# Altium project Brushless_driver_FOC_AbsoluteEncoder_V2.PrjPcb
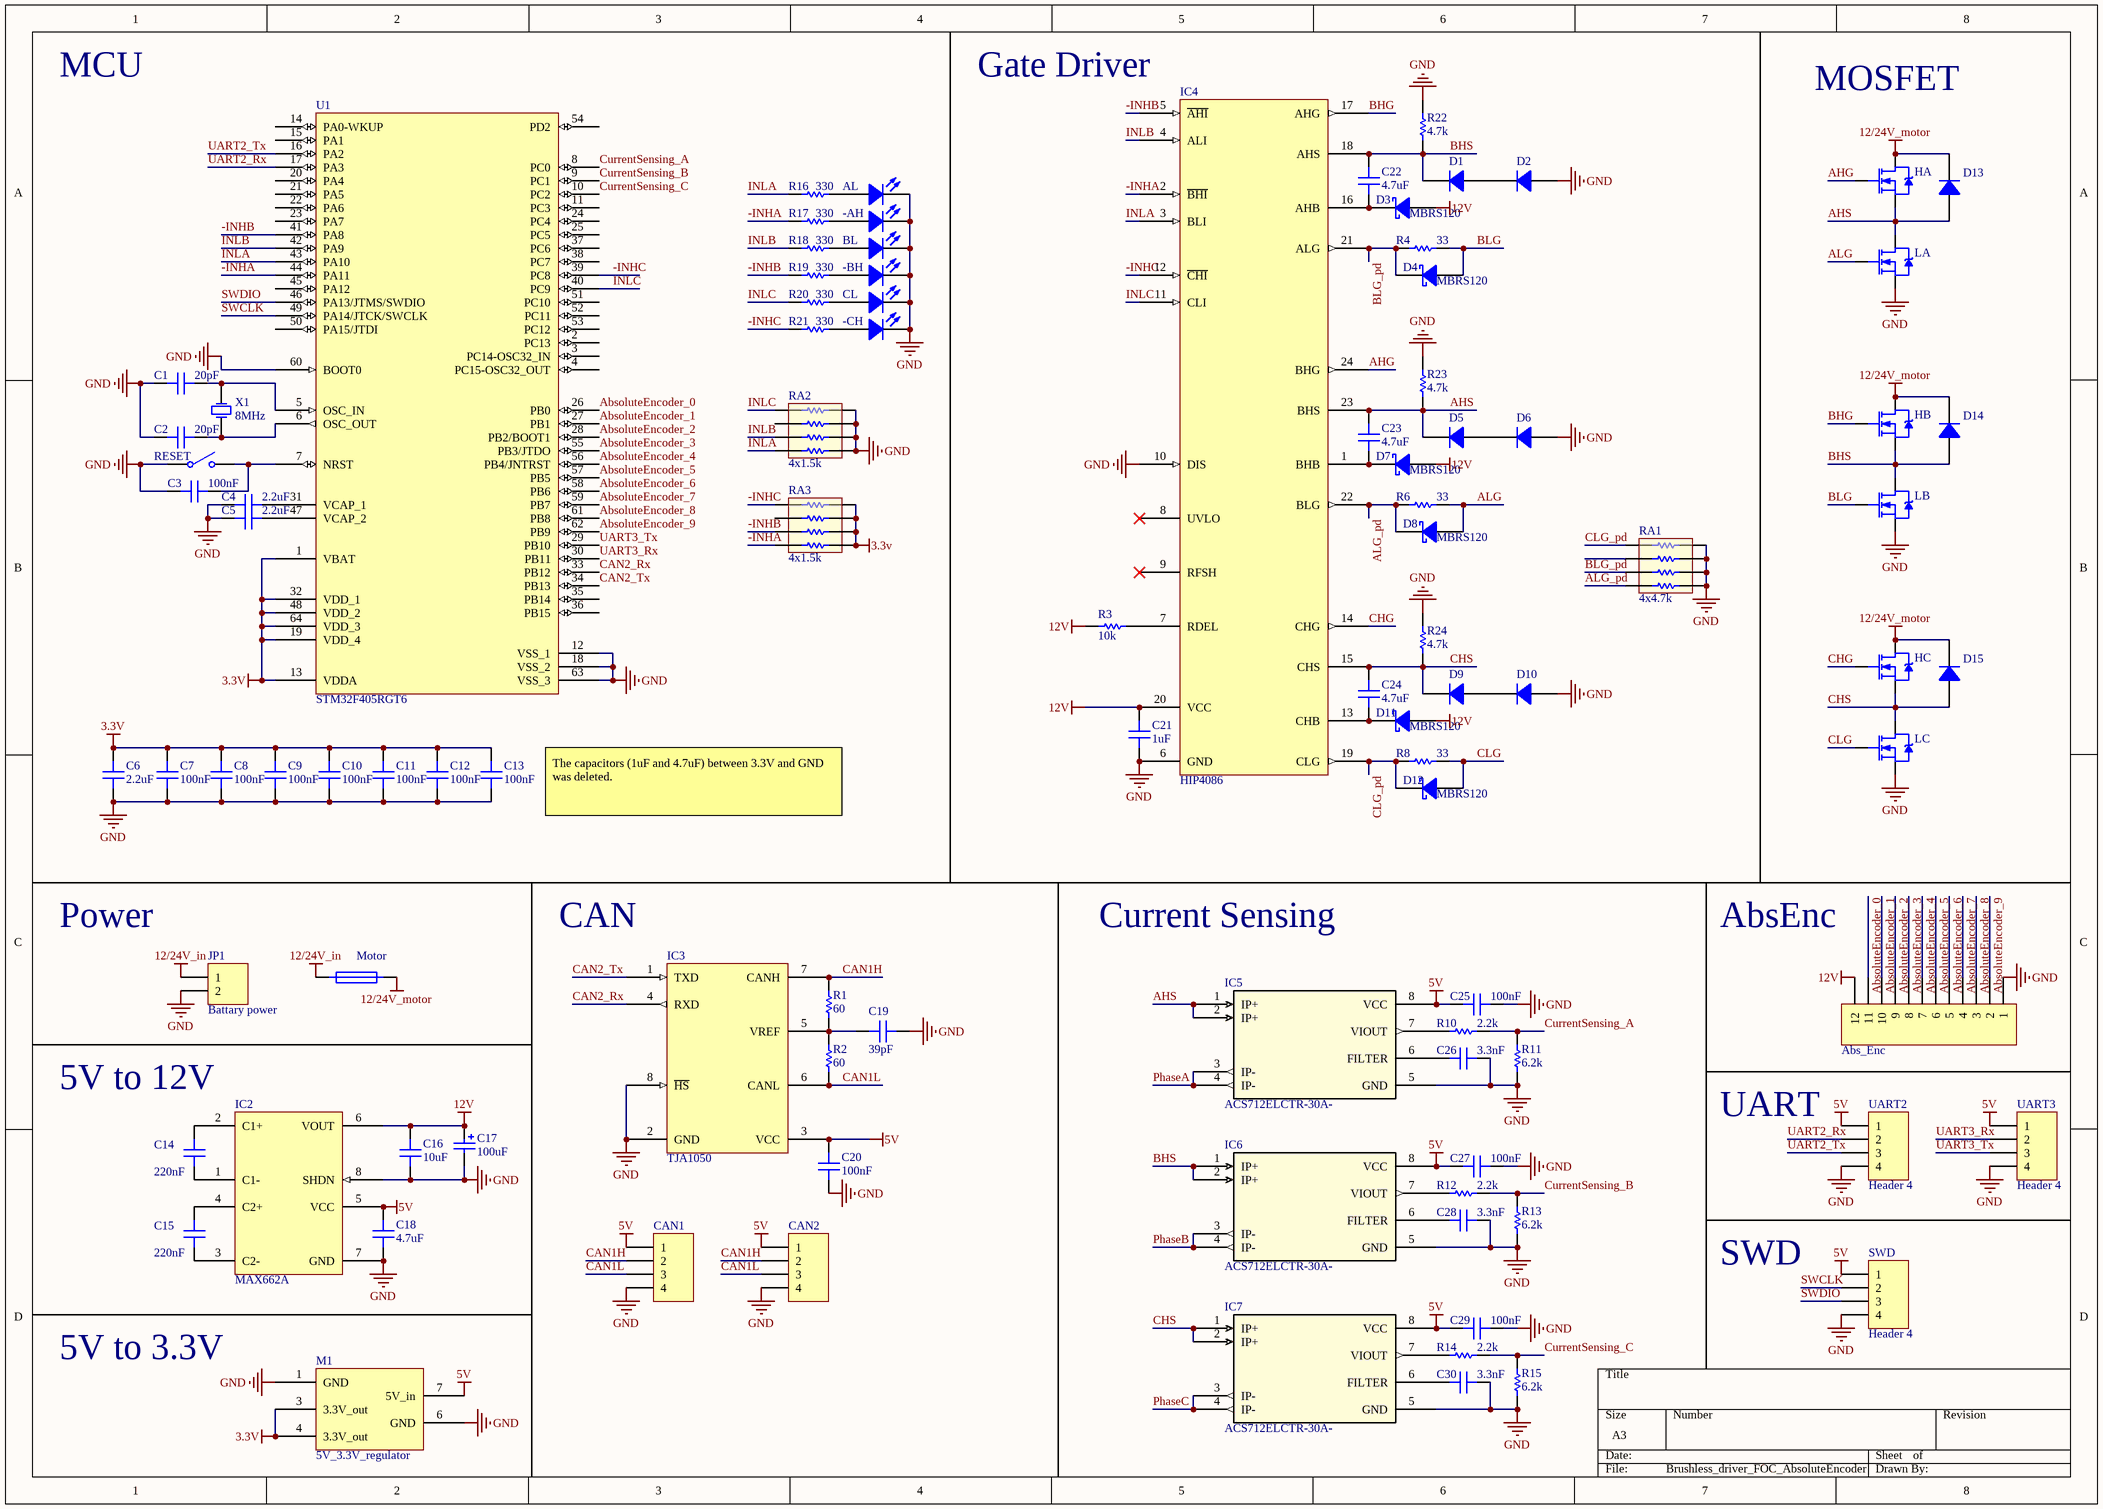
[diagram p0: Brushless_driver_FOC_AbsoluteEncoder_V2.SchDoc]
1 sheet, 99 parts. Net scope: global (net labels, ports and power ports of the same name join across sheets).
Board file: Brushless_driver_FOC_AbsoluteEncoder_V2.PcbDoc

## Sheet Brushless_driver_FOC_AbsoluteEncoder_V2.SchDoc
size A3

### Parts
-AH  (no value)  [D0805]
-BH  (no value)  [D0805]
-CH  (no value)  [D0805]
Abs_Enc  (no value)  [HDR1X12]
AL  (no value)  [D0805]
BL  (no value)  [D0805]
C1  20pF  [CC2012-0805]
C2  20pF  [CC2012-0805]
C3  100nF  [CC2012-0805]
C4  2.2uF  [CC2012-0805]
C5  2.2uF  [CC2012-0805]
C6  2.2uF  [CC2012-0805]
C7  100nF  [CC2012-0805]
C8  100nF  [CC2012-0805]
C9  100nF  [CC2012-0805]
C10  100nF  [CC2012-0805]
C11  100nF  [CC2012-0805]
C12  100nF  [CC2012-0805]
C13  100nF  [CC2012-0805]
C14  220nF  [CC2012-0805]
C15  220nF  [CC2012-0805]
C16  10uF  [CC2012-0805]
C17  100uF  [EIA7343]
C18  4.7uF  [CC2012-0805]
C19  39pF  [CC2012-0805]
C20  100nF  [CC2012-0805]
C21  1uF  [CC2012-0805]
C22  4.7uF  [CC2012-0805]
C23  4.7uF  [CC2012-0805]
C24  4.7uF  [CC2012-0805]
C25  100nF  [CC2012-0805]
C26  3.3nF  [CC2012-0805]
C27  100nF  [CC2012-0805]
C28  3.3nF  [CC2012-0805]
C29  100nF  [CC2012-0805]
C30  3.3nF  [CC2012-0805]
CAN1  (no value)  [LOCKEDHDR-4]
CAN2  (no value)  [LOCKEDHDR-4]
CL  (no value)  [D0805]
D1  (no value)  [SOD-80]
D2  (no value)  [SOD-80]
D3  MBRS120  [SMA]
D4  MBRS120  [SMA]
D5  (no value)  [SOD-80]
D6  (no value)  [SOD-80]
D7  MBRS120  [SMA]
D8  MBRS120  [SMA]
D9  (no value)  [SOD-80]
D10  (no value)  [SOD-80]
D11  MBRS120  [SMA]
D12  MBRS120  [SMA]
D13  (no value)  [SOD-80]
D14  (no value)  [SOD-80]
D15  (no value)  [SOD-80]
HA  (no value)  [TO-252AA]
HB  (no value)  [TO-252AA]
HC  (no value)  [TO-252AA]
IC2  MAX662A  [SOP-8]
IC3  TJA1050  [SOP-8]
IC4  HIP4086  [SOP-24]
IC5  ACS712ELCTR-30A-  [SOIC-8]
IC6  ACS712ELCTR-30A-  [SOIC-8]
IC7  ACS712ELCTR-30A-  [SOIC-8]
JP1  Battary power  [T-CONNECTOR(M)]
LA  (no value)  [TO-252AA]
LB  (no value)  [TO-252AA]
LC  (no value)  [TO-252AA]
M1  5V_3.3V_regulator  [5V_to_3.3_regulator_module]
Motor  (no value)  [FUSE SOCKET]
R1  60  [CR2012-0805]
R2  60  [CR2012-0805]
R3  10k  [CR2012-0805]
R4  33  [CR2012-0805]
R6  33  [CR2012-0805]
R8  33  [CR2012-0805]
R10  2.2k  [CR2012-0805]
R11  6.2k  [CR2012-0805]
R12  2.2k  [CR2012-0805]
R13  6.2k  [CR2012-0805]
R14  2.2k  [CR2012-0805]
R15  6.2k  [CR2012-0805]
R16  330  [CR2012-0805]
R17  330  [CR2012-0805]
R18  330  [CR2012-0805]
R19  330  [CR2012-0805]
R20  330  [CR2012-0805]
R21  330  [CR2012-0805]
R22  4.7k  [CR2012-0805]
R23  4.7k  [CR2012-0805]
R24  4.7k  [CR2012-0805]
RA1  4x4.7k  [ARC241-0603x4]
RA2  4x1.5k  [ARC241-0603x4]
RA3  4x1.5k  [ARC241-0603x4]
RESET  (no value)  [PUSH SWITCH]
SWD  Header 4  [LOCKEDHDR-4]
U1  STM32F405RGT6  [LQFP64]
UART2  Header 4  [LOCKEDHDR-4]
UART3  Header 4  [LOCKEDHDR-4]
X1  8MHz  [BCY-W2/E4.7]

### Nets
3.3V: C6.1 C7.1 C8.1 C9.1 C10.1 C11.1 C12.1 C13.1 M1.3(3.3V_out) M1.4(3.3V_out) RA3.2 RA3.4 RA3.6 RA3.8 U1.1(VBAT) U1.13(VDDA) U1.19(VDD_4) U1.32(VDD_1) U1.48(VDD_2) U1.64(VDD_3)
5V: C18.1 C20.1 C25.1 C27.1 C29.1 CAN1.1 CAN2.1 IC2.5(VCC) IC3.3(VCC) IC5.8(VCC) IC6.8(VCC) IC7.8(VCC) M1.7(5V_in) SWD.1 UART2.1 UART3.1
12/24V_in: JP1.1 Motor.1
12/24V_motor: D13.2(K) D14.2(K) D15.2(K) HA.4(D) HB.4(D) HC.4(D) Motor.2
12V: Abs_Enc.12 C16.1 C17.1 C21.1 D3.1(A) D7.1(A) D11.1(A) IC2.6(VOUT) IC4.20(VCC) R3.1
GND: -AH.2(K) -BH.2(K) -CH.2(K) Abs_Enc.1 AL.2(K) BL.2(K) C1.1 C2.1 C3.1 C4.1 C5.1 C6.2 C7.2 C8.2 C9.2 C10.2 C11.2 C12.2 C13.2 C16.2 C17.2 C18.2 C19.2 C20.2 C21.2 C25.2 C26.2 C27.2 C28.2 C29.2 C30.2 CAN1.4 CAN2.4 CL.2(K) D2.1(A) D6.1(A) D10.1(A) IC2.7(GND) IC2.8(SHDN) IC3.2(GND) IC3.8(~{HS}) IC4.6(GND) IC4.10(DIS) IC5.5(GND) IC6.5(GND) IC7.5(GND) JP1.2 LA.3(S) LB.3(S) LC.3(S) M1.1(GND) M1.6(GND) R11.1 R13.1 R15.1 R22.2 R23.2 R24.2 RA1.2 RA1.4 RA1.6 RA1.8 RA2.2 RA2.4 RA2.6 RA2.8 RESET.1(COMMON) SWD.4 U1.12(VSS_1) U1.18(VSS_2) U1.60(BOOT0) U1.63(VSS_3) UART2.4 UART3.4
-INHA: IC4.2(~{BHI}) R17.1 RA3.7 U1.44(PA11)
-INHB: IC4.5(~{AHI}) R19.1 RA3.5 U1.41(PA8)
-INHC: IC4.12(~{CHI}) R21.1 RA3.1 U1.39(PC8)
AbsoluteEncoder_0: Abs_Enc.11 U1.26(PB0)
AbsoluteEncoder_1: Abs_Enc.10 U1.27(PB1)
AbsoluteEncoder_2: Abs_Enc.9 U1.28(PB2/BOOT1)
AbsoluteEncoder_3: Abs_Enc.8 U1.55(PB3/JTDO)
AbsoluteEncoder_4: Abs_Enc.7 U1.56(PB4/JNTRST)
AbsoluteEncoder_5: Abs_Enc.6 U1.57(PB5)
AbsoluteEncoder_6: Abs_Enc.5 U1.58(PB6)
AbsoluteEncoder_7: Abs_Enc.4 U1.59(PB7)
AbsoluteEncoder_8: Abs_Enc.3 U1.61(PB8)
AbsoluteEncoder_9: Abs_Enc.2 U1.62(PB9)
AHG: HA.1(G) IC4.24(BHG)
AHS: C23.1 D5.2(K) D13.1(A) HA.3(S) IC4.23(BHS) IC5.1(IP+) IC5.2(IP+) LA.4(D) R23.1
ALG: D8.1(A) LA.1(G) R6.1
ALG_pd: D8.2(K) IC4.22(BLG) R6.2 RA1.7
BHG: HB.1(G) IC4.17(AHG)
BHS: C22.1 D1.2(K) D14.1(A) HB.3(S) IC4.18(AHS) IC6.1(IP+) IC6.2(IP+) LB.4(D) R22.1
BLG: D4.1(A) LB.1(G) R4.1
BLG_pd: D4.2(K) IC4.21(ALG) R4.2 RA1.5
CAN1H: CAN1.2 CAN2.2 IC3.7(CANH) R1.1
CAN1L: CAN1.3 CAN2.3 IC3.6(CANL) R2.1
CAN2_Rx: IC3.4(RXD) U1.33(PB12)
CAN2_Tx: IC3.1(TXD) U1.34(PB13)
CHG: HC.1(G) IC4.14(CHG)
CHS: C24.1 D9.2(K) D15.1(A) HC.3(S) IC4.15(CHS) IC7.1(IP+) IC7.2(IP+) LC.4(D) R24.1
CLG: D12.1(A) LC.1(G) R8.1
CLG_pd: D12.2(K) IC4.19(CLG) R8.2 RA1.1
CurrentSensing_A: R10.2 R11.2 U1.8(PC0)
CurrentSensing_B: R12.2 R13.2 U1.9(PC1)
CurrentSensing_C: R14.2 R15.2 U1.10(PC2)
INLA: IC4.3(BLI) R16.1 RA2.7 U1.43(PA10)
INLB: IC4.4(ALI) R18.1 RA2.5 U1.42(PA9)
INLC: IC4.11(CLI) R20.1 RA2.1 U1.40(PC9)
PhaseA: IC5.3(IP-) IC5.4(IP-)
PhaseB: IC6.3(IP-) IC6.4(IP-)
PhaseC: IC7.3(IP-) IC7.4(IP-)
SWCLK: SWD.2 U1.49(PA14/JTCK/SWCLK)
SWDIO: SWD.3 U1.46(PA13/JTMS/SWDIO)
UART2_Rx: U1.17(PA3) UART2.2
UART2_Tx: U1.16(PA2) UART2.3
UART3_Rx: U1.30(PB11) UART3.2
UART3_Tx: U1.29(PB10) UART3.3
Net-AH_1: -AH.1(A) R17.2
Net-BH_1: -BH.1(A) R19.2
Net-CH_1: -CH.1(A) R21.2
NetAL_1: AL.1(A) R16.2
NetBL_1: BL.1(A) R18.2
NetC1_2: C1.2 U1.5(OSC_IN) X1.2(OSC2)
NetC2_2: C2.2 U1.6(OSC_OUT) X1.1(OSC1)
NetC3_2: C3.2 RESET.2(NO) U1.7(NRST)
NetC4_2: C4.2 U1.31(VCAP_1)
NetC5_2: C5.2 U1.47(VCAP_2)
NetC14_1: C14.1 IC2.1(C1-)
NetC14_2: C14.2 IC2.2(C1+)
NetC15_1: C15.1 IC2.3(C2-)
NetC15_2: C15.2 IC2.4(C2+)
NetC19_1: C19.1 IC3.5(VREF) R1.2 R2.2
NetC22_2: C22.2 D3.2(K) IC4.16(AHB)
NetC23_2: C23.2 D7.2(K) IC4.1(BHB)
NetC24_2: C24.2 D11.2(K) IC4.13(CHB)
NetC26_1: C26.1 IC5.6(FILTER)
NetC28_1: C28.1 IC6.6(FILTER)
NetC30_1: C30.1 IC7.6(FILTER)
NetCL_1: CL.1(A) R20.2
NetD1_1: D1.1(A) D2.2(K)
NetD5_1: D5.1(A) D6.2(K)
NetD9_1: D9.1(A) D10.2(K)
NetIC4_7: IC4.7(RDEL) R3.2
NetIC5_7: IC5.7(VIOUT) R10.1
NetIC6_7: IC6.7(VIOUT) R12.1
NetIC7_7: IC7.7(VIOUT) R14.1

Not connected (* = marked no-connect by the designer): IC4 8(UVLO)* 9(RFSH)*; RA1 3; RA2 3; RA3 3; U1 2(PC13) 3(PC14-OSC32_IN) 4(PC15-OSC32_OUT) 11(PC3) 14(PA0-WKUP) 15(PA1) 20(PA4) 21(PA5) 22(PA6) 23(PA7) 24(PC4) 25(PC5) 35(PB14) 36(PB15) 37(PC6) 38(PC7) 45(PA12) 50(PA15/JTDI) 51(PC10) 52(PC11) 53(PC12) 54(PD2)

### Notes on the sheet
- MCU
- (near IC4) Gate Driver
- MOSFET
- The capacitors (1uF and 4.7uF) between 3.3V and GND was deleted.
- Power
- CAN
- Current Sensing
- AbsEnc
- 5V to 12V
- UART
- SWD
- 5V to 3.3V

### Library data of the parts
-AH -BH -CH AL BL CL = LED: Typical RED GaAs LED; Published: 8-Jun-2000; LatestRevisionDate: 08-Jul-2005; LatestRevisionNote: Mech Layer 1 removed.; PackageReference: LED-1; Publisher: Altium Limited
Abs_Enc = Header 12: Header, 12-Pin; LatestRevisionDate: 17-Jul-2002; LatestRevisionNote: Re-released for DXP Platform.; Publisher: Altium Limited
C1-C16 C18-C30 = Cap Semi: Capacitor (Semiconductor SIM Model); Published: 8-Jun-2000; LatestRevisionDate: 17-Jul-2002; LatestRevisionNote: Re-released for DXP Platform.; PackageReference: C1206; Publisher: Altium Limited
C17 = Cap Pol SMD: Polarized Capacitor (Axial); Published: 8-Jun-2000; LatestRevisionDate: 17-Jul-2002; LatestRevisionNote: Re-released for DXP Platform.; Publisher: Altium Limited
CAN1 CAN2 SWD UART2 UART3 = Header 4: Header, 4-Pin; Revision: 17-Jul-2002: Re-released for DXP Platform.; Publisher: Altium Limited
D1 D2 D5 D6 D9 D10 D13-D15 = D General: General Purpose Diode; Revision 1: 11-Jul-2000: SIM Model Added.; Revision 2: 17-Jul-2002: Re-released for DXP Platform.; Code - JEDEC: DO-204-AH; Published: 8-Jun-2000; Datasheet: Latest Revision: 1997; Package Reference: DO-35; Publisher: Altium Limited
D3 D4 D7 D8 D11 D12 = D Schottky: Schottky Diode; Code - JEDEC: DO-214-AA; Published: 8-Jun-2000; Revision: July-2002: Re-released for DXP Platform.; Publisher: Altium Limited
HA HB HC LA LB LC = IRLR3705: HEXFET N-Channel Power MOSFET; Note: Pin 2 is trimmed and is electrically connected to Drain.; Published: 8-Jun-2000; LatestRevisionDate: 17-Jul-2002; LatestRevisionNote: Re-released for DXP Platform.; DatasheetDocument: Nov-1998; PackageReference: TO-252AA; Publisher: Altium Limited; Code_JEDEC: TO-252-AA
IC2 = MAX662A: 5V to 12V Charge Pump
IC3 = TJA1050: 5V to 12V Charge Pump
IC4 = HIP4086: 80V, 500mA, 3-Phase MOSFET Driver80V, 500mA, 3-Phase MOSFET Driver
IC5-IC7 = ACS712ELCTR-30A-: Imported; Manufacturer_Part_Number: ACS712ELCTR-30A-T; Vendor: Allegro Microsystems Inc.; Built_By: EMA_UL_Team; C: Copyright (C) 2015 Accelerated Designs. All rights reserved; RefDes: RefDes; Type: DEV; Value: Value
JP1 = Header 2: Header, 2-Pin; Revision: 17-Jul-2002: Re-released for DXP Platform.; Publisher: Altium Limited
Motor = Fuse: Published: 8-Jun-2000; Revision: July-2002: Re-released for DXP Platform.; Publisher: Altium Limited
R1-R4 R6 R8 R10-R24 = Res Semi: Semiconductor Resistor; Published: 8-Jun-2000; LatestRevisionDate: 17-Jul-2002; LatestRevisionNote: Re-released for DXP Platform.; Publisher: Altium Limited
RA1-RA3 = Res Array: 4x Resistor Array; Published: 8-Jun-2000; LatestRevisionDate: 17-Jul-2002; LatestRevisionNote: Re-released for DXP Platform.; Publisher: Altium Limited
RESET = SW-SPST: Single-Pole, Single-Throw Switch; Published: 24-Mar-1999; Revision: July-2002: Re-released for DXP Platform.; Publisher: Altium Limited
X1 = XTAL: Crystal Oscillator; Published: 8-Jun-2000; Revision: July-2002: Re-released for DXP Platform.; Publisher: Altium Limited